# Altium schematic sheet 7Seg.SchDoc
size A4
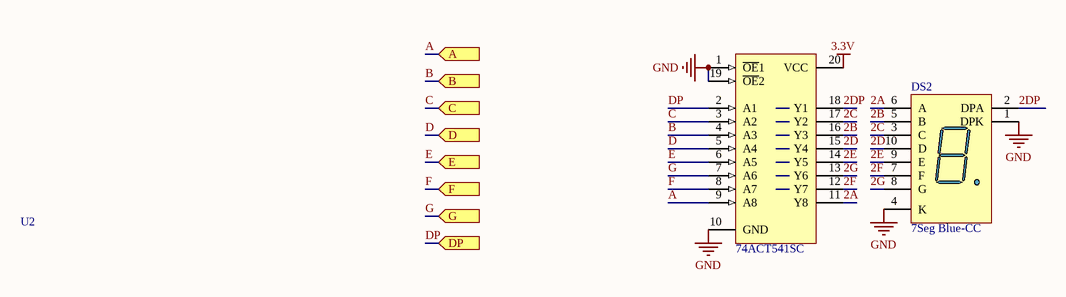
[diagram p0: 7Seg.SchDoc]

## Parts
DS2  7Seg Blue-CC  [7Segment Small]
U2  74ACT541SC  [M20B_M]

## Ports
A (in), B (in), C (in), D (in), DP (in), E (in), F (in), G (in)

## Nets
3.3V: U2.20(VCC)
GND: DS2.1(DPK) DS2.4(K) U2.1(~{OE}1) U2.10(GND) U2.19(~{OE}2)
2A: DS2.6(A) U2.11(Y8)
2B: DS2.5(B) U2.16(Y3)
2C: DS2.3(C) U2.17(Y2)
2D: DS2.10(D) U2.15(Y4)
2DP: DS2.2(DPA) U2.18(Y1)
2E: DS2.9(E) U2.14(Y5)
2F: DS2.7(F) U2.12(Y7)
2G: DS2.8(G) U2.13(Y6)
A: U2.9(A8) ; port A
B: U2.4(A3) ; port B
C: U2.3(A2) ; port C
D: U2.5(A4) ; port D
DP: U2.2(A1) ; port DP
E: U2.6(A5) ; port E
F: U2.8(A7) ; port F
G: U2.7(A6) ; port G

## Library data of the parts
DS2 = 7Seg Blue-CC_1: 14.2 mm General Purpose Blue 7-Segment Display: CC, RH DP, Gray Surface; MinimumIntensity: 2020 ucd; Note: IF = 10 mA; Published: 8-Jun-2000; LatestRevisionDate: 17-Dec-2003; LatestRevisionNote: Schematic revised, PCB Footprint replaced.; DatasheetDocument: 24-Sep-2002; PackageDocument: 24-Sep-2002; PackageReference: H; Publisher: Altium Limited; Colour: Blue; ComponentLink1Description: Manufacturer Link; ComponentLink1URL: http://www.agilent.com/
U2 = 74ACT541SC: Octal Buffer/Line Driver with 3-State Output; Published: 17-Jul-2002; LatestRevisionDate: 13-Apr-2006; LatestRevisionNote: IPC-7351 Footprint Added.; DatasheetVersion: Oct-1999; PackageVersion: 2000; PackageReference: M20B; Publisher: Altium Limited; PackageDescription: 20-Pin Small Outline Integrated Circuit 1.27 mm Pitch; Code_JEDEC: MS-013-AC; Code_IPC: SOIC127P1030-20; ComponentLink1Description: Manufacturer Link; ComponentLink1URL: http://www.fairchildsemi.com/; ComponentLink2Description: Datasheet; ComponentLink2URL: http://www.fairchildsemi.com/ds/74%2F74AC541.pdf